# Altium schematic sheet RS485Comm.SchDoc
size A3
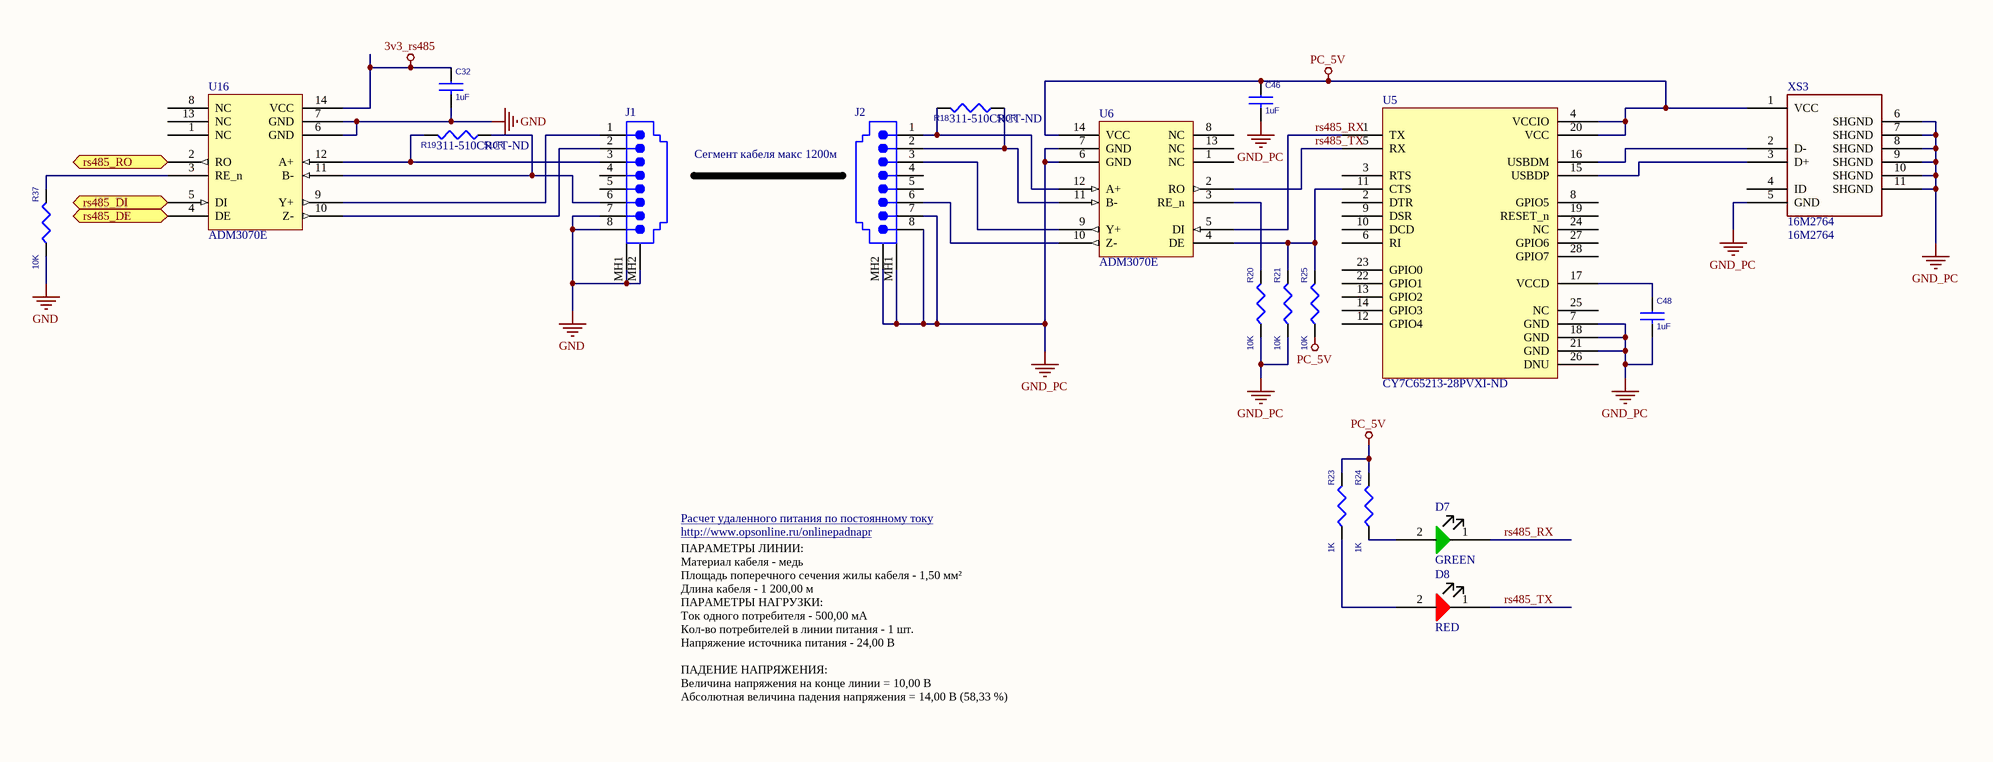
[diagram p0: RS485Comm.SchDoc]

## Parts
C32  1uF  [CAPC2012X09M]
C46  1uF  [CAPC2012X09M]
C48  1uF  [CAPC2012X09M]
D7  GREEN  [DIOC2012X11N]
D8  RED  [DIOC2012X11N]
J1  RJ-45  [RJ-45_PCB]  (value not drawn)
J2  RJ-45  [RJ-45_PCB]  (value not drawn)
R18  510R  Supplier Part Number 1: 311-510CRCT-ND  [RESC2013X06M]
R19  510R  Supplier Part Number 1: 311-510CRCT-ND  [RESC2013X06M]
R20  10K  [RESC2013X06M]
R21  10K  [RESC2013X06M]
R23  1K  [RESC2013X06M]
R24  1K  [RESC2013X06M]
R25  10K  [RESC2013X06M]
R37  10K  [RESC2013X06M]
U5  Supplier Part Number 1: CY7C65213-28PVXI-ND  [SOP65P780X200-28M]  (hidden comment: CY7C65213)
U6  ADM3070E  [SOIC127P600X175-14N]
U16  ADM3070E  [SOIC127P600X175-14N]
XS3  16M2764  [USB_MINI_16M2764]

## Ports
rs485_DE (in), rs485_DI (in), rs485_RO (out)

## Nets
3v3_rs485: C32.1 U16.14(VCC)
GND: C32.2 J1.7 J1.8 J1.MH1(Shield) J1.MH2(Shield) R37.1 U16.6(GND) U16.7(GND)
GND_PC: C46.2 C48.2 J2.7 J2.8 J2.MH1(Shield) J2.MH2(Shield) R20.1 R21.1 U5.7(GND) U5.18(GND) U5.21(GND) U6.6(GND) U6.7(GND) XS3.5(GND) XS3.6(SHGND) XS3.7(SHGND) XS3.8(SHGND) XS3.9(SHGND) XS3.10(SHGND) XS3.11(SHGND)
PC_5V: C46.1 R23.2 R24.2 R25.1 U5.4(VCCIO) U5.20(VCC) U6.14(VCC) XS3.1(VCC)
rs485_DE: U16.4(DE) ; port rs485_DE
rs485_DI: U16.5(DI) ; port rs485_DI
rs485_RO: U16.2(RO) ; port rs485_RO
rs485_RX: D7.1(C) U5.1(TX) U6.5(DI)
rs485_TX: D8.1(C) U5.5(RX) U6.2(RO)
NetC48_1: C48.1 U5.17(VCCD)
NetD7_2: D7.2(A) R24.1
NetD8_2: D8.2(A) R23.1
NetJ1_1: J1.1 U16.9(Y+)
NetJ1_2: J1.2 U16.10(Z-)
NetJ1_3: J1.3 R19.2 U16.12(A+)
NetJ1_6: J1.6 R19.1 U16.11(B-)
NetJ2_1: J2.1 R18.2 U6.12(A+)
NetJ2_2: J2.2 R18.1 U6.11(B-)
NetJ2_3: J2.3 U6.9(Y+)
NetJ2_6: J2.6 U6.10(Z-)
NetR20_2: R20.2 U6.3(RE_n)
NetR21_2: R21.2 R25.2 U5.11(CTS) U6.4(DE)
NetR37_2: R37.2 U16.3(RE_n)
NetU5_15: U5.15(USBDP) XS3.3(D+)
NetU5_16: U5.16(USBDM) XS3.2(D-)

Not connected (* = marked no-connect by the designer): J1 4 5; J2 4 5; U5 2(DTR) 3(RTS) 6(RI) 8(GPIO5) 9(DSR) 10(DCD) 12(GPIO4) 13(GPIO2) 14(GPIO3) 19(RESET_n) 22(GPIO1) 23(GPIO0) 24(NC) 25(NC) 26(DNU) 27(GPIO6) 28(GPIO7); U6 1(NC) 8(NC) 13(NC); U16 1(NC) 8(NC) 13(NC); XS3 4(ID)

## Notes on the sheet
- Сегмент кабеля макс 1200м
- http://www.opsonline.ru/onlinepadnapr
- Расчет удаленного питания по постоянному току
- ПАРАМЕТРЫ ЛИНИИ:
  Материал кабеля - медь
  Площадь поперечного сечения жилы кабеля - 1,50 мм²
  Длина кабеля - 1 200,00 м
  ПАРАМЕТРЫ НАГРУЗКИ:
  Ток одного потребителя - 500,00 мА
  Кол-во потребителей в линии питания - 1 шт.
  Напряжение источника питания - 24,00 В
  ПАДЕНИЕ НАПРЯЖЕНИЯ:
  Величина напряжения на конце линии = 10,00 В
  Абсолютная величина падения напряжения = 14,00 В (58,33 %)

## Library data of the parts
C32 C46 C48 = CAP_SMD_1uF_10%: MLCC; 1uF; 25V; X7R; ±10%; SMD; 0805;; Value: 1uF; Supplier 1: Digi-Key; Supplier Part Number 1: 1276-1066-1-ND
D7 = LED_GREEN: Supplier 1: Digi-Key; Supplier Part Number 1: 160-1179-2-ND
D8 = LED_RED: Supplier 1: Digi-Key; Supplier Part Number 1: 160-1176-1-ND
J1 J2 = RJ-45: High-Speed, Vertical, Standard Profile, Internal Shield PCB Jack
R18 R19 = RES_SMD_510_5%: RES - 510 OHM, 5%, 1/8W, 0805 SMD; Supplier 1: Digi-Key
R20 R21 R25 R37 = RES_SMD_10K_5%: RES 10K OHM 1/8W 5% 0805 SMD; Supplier 1: Digi-Key; Supplier Part Number 1: 311-10KARCT-ND
R23 R24 = RES_SMD_1K_5%: RES - 1K OHM, 5%, 1/8W, 0805 SMD; Supplier 1: Digi-Key; Supplier Part Number 1: P1.0KADKR-ND
XS3 = USB_MINI_16M2764: Supplier 1: Newark; Supplier Part Number 1: 16M2764
U5 = CY7C65213: Supplier 1: Digi-Key